# Altium schematic sheet Zones.SchDoc
size A2
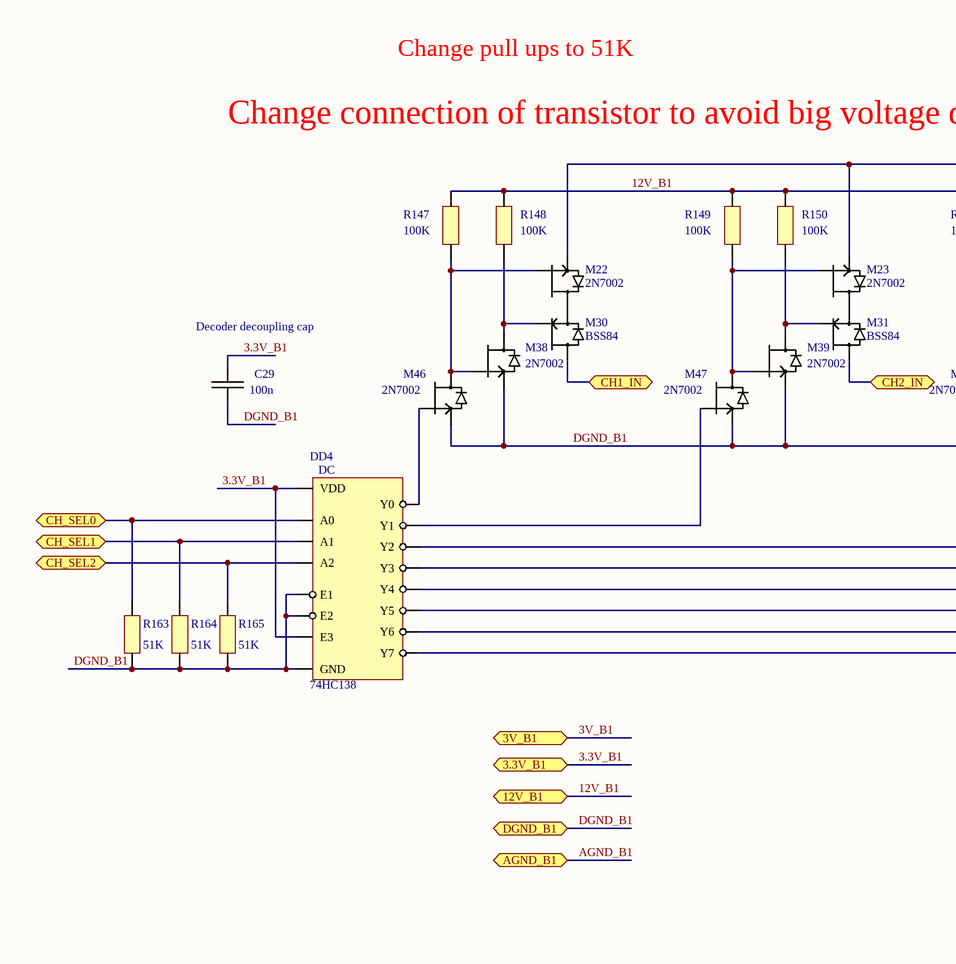
[diagram p0: Zones.SchDoc, left]
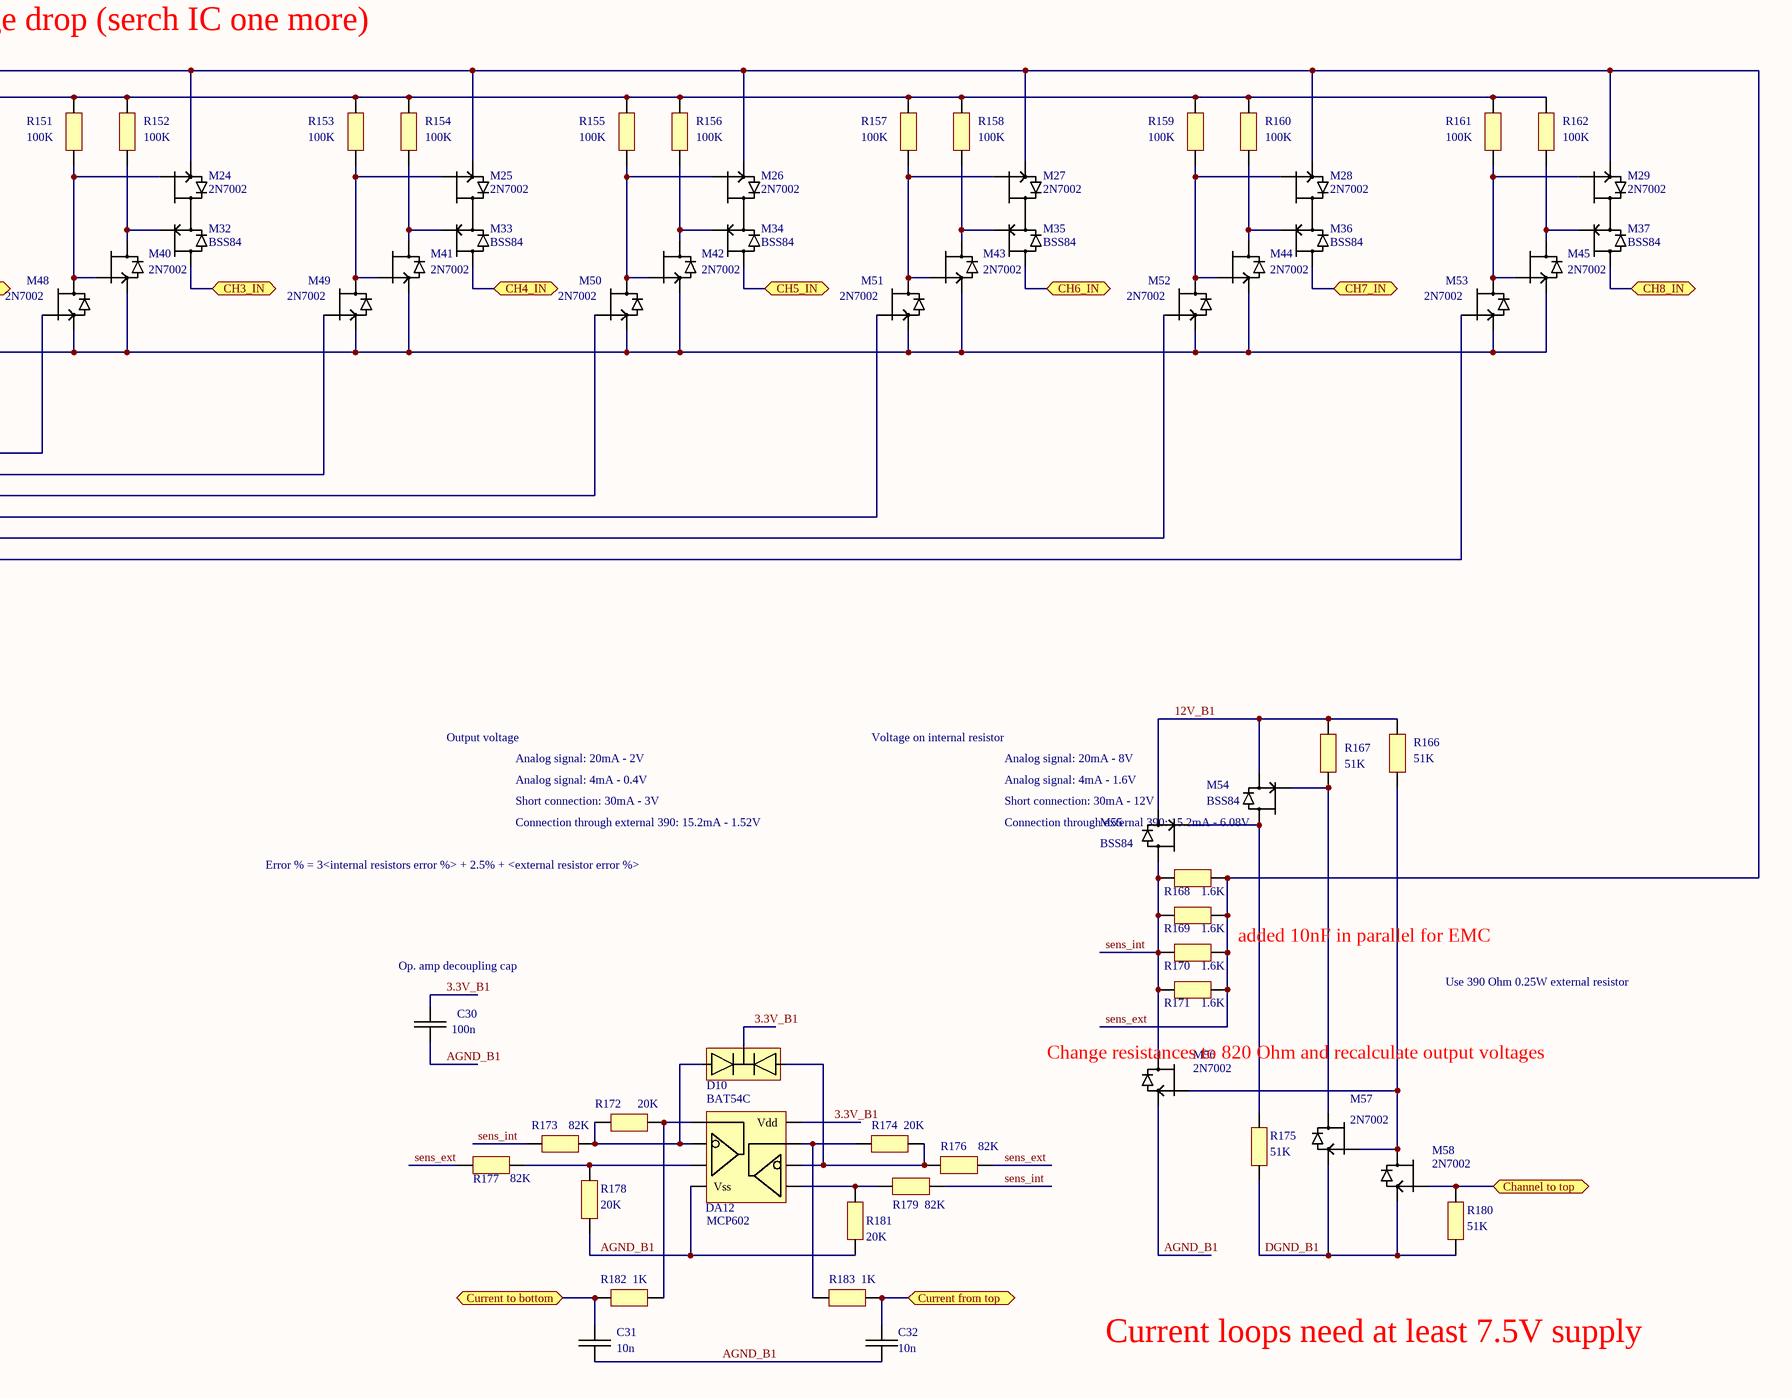
[diagram p1: Zones.SchDoc, right]

## Parts
C29  100n  [0805]
C30  100n  [0805]
C31  10n  [0805]
C32  10n  [0805]
D10  BAT54C  [SOT-23]
DA12  MCP602  [SOP8]
DD4  74HC138  [SOP16]
M22  2N7002  [SOT-23]
M23  2N7002  [SOT-23]
M24  2N7002  [SOT-23]
M25  2N7002  [SOT-23]
M26  2N7002  [SOT-23]
M27  2N7002  [SOT-23]
M28  2N7002  [SOT-23]
M29  2N7002  [SOT-23]
M30  BSS84  [SOT-23]
M31  BSS84  [SOT-23]
M32  BSS84  [SOT-23]
M33  BSS84  [SOT-23]
M34  BSS84  [SOT-23]
M35  BSS84  [SOT-23]
M36  BSS84  [SOT-23]
M37  BSS84  [SOT-23]
M38  2N7002  [SOT-23]
M39  2N7002  [SOT-23]
M40  2N7002  [SOT-23]
M41  2N7002  [SOT-23]
M42  2N7002  [SOT-23]
M43  2N7002  [SOT-23]
M44  2N7002  [SOT-23]
M45  2N7002  [SOT-23]
M46  2N7002  [SOT-23]
M47  2N7002  [SOT-23]
M48  2N7002  [SOT-23]
M49  2N7002  [SOT-23]
M50  2N7002  [SOT-23]
M51  2N7002  [SOT-23]
M52  2N7002  [SOT-23]
M53  2N7002  [SOT-23]
M54  BSS84  [SOT-23]
M55  BSS84  [SOT-23]
M56  2N7002  [SOT-23]
M57  2N7002  [SOT-23]
M58  2N7002  [SOT-23]
R147  100K  [0805]
R148  100K  [0805]
R149  100K  [0805]
R150  100K  [0805]
R151  100K  [0805]
R152  100K  [0805]
R153  100K  [0805]
R154  100K  [0805]
R155  100K  [0805]
R156  100K  [0805]
R157  100K  [0805]
R158  100K  [0805]
R159  100K  [0805]
R160  100K  [0805]
R161  100K  [0805]
R162  100K  [0805]
R163  51K  [0805]
R164  51K  [0805]
R165  51K  [0805]
R166  51K  [0805]
R167  51K  [0805]
R168  1.6K  [1206]
R169  1.6K  [1206]
R170  1.6K  [1206]
R171  1.6K  [1206]
R172  20K  [0805]
R173  82K  [0805]
R174  20K  [0805]
R175  51K  [0805]
R176  82K  [0805]
R177  82K  [0805]
R178  20K  [0805]
R179  82K  [0805]
R180  51K  [0805]
R181  20K  [0805]
R182  1K  [0805]
R183  1K  [0805]

## Ports
3.3V_B1, 3V_B1, 12V_B1, AGND_B1, CH1_IN, CH2_IN, CH3_IN, CH4_IN, CH5_IN, CH6_IN, CH7_IN, CH8_IN, CH_SEL0, CH_SEL1, CH_SEL2, Channel to top, Current from top, Current to bottom, DGND_B1

## Nets
3.3V_B1: C29.2 C30.2 D10.3(AK) DA12.8(Vdd) DD4.6(E3) DD4.16(VDD) ; port 3.3V_B1
3V_B1: port 3V_B1
12V_B1: M54.2 M55.2 R147.1 R148.1 R149.1 R150.1 R151.1 R152.1 R153.1 R154.1 R155.1 R156.1 R157.1 R158.1 R159.1 R160.1 R161.1 R162.1 R166.1 R167.1 ; port 12V_B1
AGND_B1: C30.1 C31.1 C32.1 DA12.4(Vss) M56.2 R178.2 R181.2 ; port AGND_B1
CH1_IN: M30.3 ; port CH1_IN
CH2_IN: M31.3 ; port CH2_IN
CH3_IN: M32.3 ; port CH3_IN
CH4_IN: M33.3 ; port CH4_IN
CH5_IN: M34.3 ; port CH5_IN
CH6_IN: M35.3 ; port CH6_IN
CH7_IN: M36.3 ; port CH7_IN
CH8_IN: M37.3 ; port CH8_IN
CH_SEL0: DD4.1(A0) R163.1 ; port CH_SEL0
CH_SEL1: DD4.2(A1) R164.1 ; port CH_SEL1
CH_SEL2: DD4.3(A2) R165.1 ; port CH_SEL2
Channel to top: M58.1 R180.1 ; port Channel to top
Current from top: C32.2 R183.1 ; port Current from top
Current to bottom: C31.2 R182.2 ; port Current to bottom
DGND_B1: C29.1 DD4.4(E1) DD4.5(E2) DD4.8(GND) M38.2 M39.2 M40.2 M41.2 M42.2 M43.2 M44.2 M45.2 M46.2 M47.2 M48.2 M49.2 M50.2 M51.2 M52.2 M53.2 M57.2 M58.2 R163.2 R164.2 R165.2 R175.2 R180.2 ; port DGND_B1
sens_ext: M22.2 M23.2 M24.2 M25.2 M26.2 M27.2 M28.2 M29.2 R168.1 R169.1 R170.1 R171.1 R176.1 R177.1
sens_int: M55.3 M56.3 R168.2 R169.2 R170.2 R171.2 R173.1 R179.1
NetD10_1: D10.1(A1) DA12.6 R174.1 R176.2
NetD10_2: D10.2(K2) DA12.2 R172.1 R173.2
NetDA12_1: DA12.1 R172.2 R182.1
NetDA12_3: DA12.3 R177.2 R178.1
NetDA12_5: DA12.5 R179.2 R181.1
NetDA12_7: DA12.7 R174.2 R183.2
NetDD4_7: DD4.7(Y7) M53.1
NetDD4_9: DD4.9(Y6) M52.1
NetDD4_10: DD4.10(Y5) M51.1
NetDD4_11: DD4.11(Y4) M50.1
NetDD4_12: DD4.12(Y3) M49.1
NetDD4_13: DD4.13(Y2) M48.1
NetDD4_14: DD4.14(Y1) M47.1
NetDD4_15: DD4.15(Y0) M46.1
NetM22_1: M22.1 M38.1 M46.3 R147.2
NetM22_3: M22.3 M30.2
NetM23_1: M23.1 M39.1 M47.3 R149.2
NetM23_3: M23.3 M31.2
NetM24_1: M24.1 M40.1 M48.3 R151.2
NetM24_3: M24.3 M32.2
NetM25_1: M25.1 M41.1 M49.3 R153.2
NetM25_3: M25.3 M33.2
NetM26_1: M26.1 M42.1 M50.3 R155.2
NetM26_3: M26.3 M34.2
NetM27_1: M27.1 M43.1 M51.3 R157.2
NetM27_3: M27.3 M35.2
NetM28_1: M28.1 M44.1 M52.3 R159.2
NetM28_3: M28.3 M36.2
NetM29_1: M29.1 M45.1 M53.3 R161.2
NetM29_3: M29.3 M37.2
NetM30_1: M30.1 M38.3 R148.2
NetM31_1: M31.1 M39.3 R150.2
NetM32_1: M32.1 M40.3 R152.2
NetM33_1: M33.1 M41.3 R154.2
NetM34_1: M34.1 M42.3 R156.2
NetM35_1: M35.1 M43.3 R158.2
NetM36_1: M36.1 M44.3 R160.2
NetM37_1: M37.1 M45.3 R162.2
NetM54_1: M54.1 M57.3 R167.2
NetM54_3: M54.3 M55.1 R175.1
NetM56_1: M56.1 M57.1 M58.3 R166.2

## Notes on the sheet
- Change pull ups to 51K
- Change connection of transistor to avoid big voltage drop (serch IC one more)
- (near C29) Decoder decoupling cap
- Output voltage
- Analog signal: 20mA - 2V
- Voltage on internal resistor
- Analog signal: 20mA - 8V
- Short connection: 30mA - 3V
- Analog signal: 4mA - 0.4V
- Connection through external 390: 15.2mA - 1.52V
- Short connection: 30mA - 12V
- Analog signal: 4mA - 1.6V
- Connection through external 390: 15.2mA - 6.08V
- Error % = 3<internal resistors error %> + 2.5% + <external resistor error %>
- (near C30) Op. amp decoupling cap
- added 10nF in parallel for EMC
- Use 390 Ohm 0.25W external resistor
- (near M56) Change resistances to 820 Ohm and recalculate output voltages
- Current loops need at least 7.5V supply
- (in symbol 74HC138) DC

## Library data of the parts
C29-C32 = C
D10 = 2xD2
DA12 = 2xOP.AMP
M22-M29 M38-M53 M56-M58 = NMOS+DIODE
M30-M37 M54 M55 = PMOS+DIODE
R147-R183 = R